# Altium schematic sheet SH4 - PWM + CAN.SchDoc
size Letter
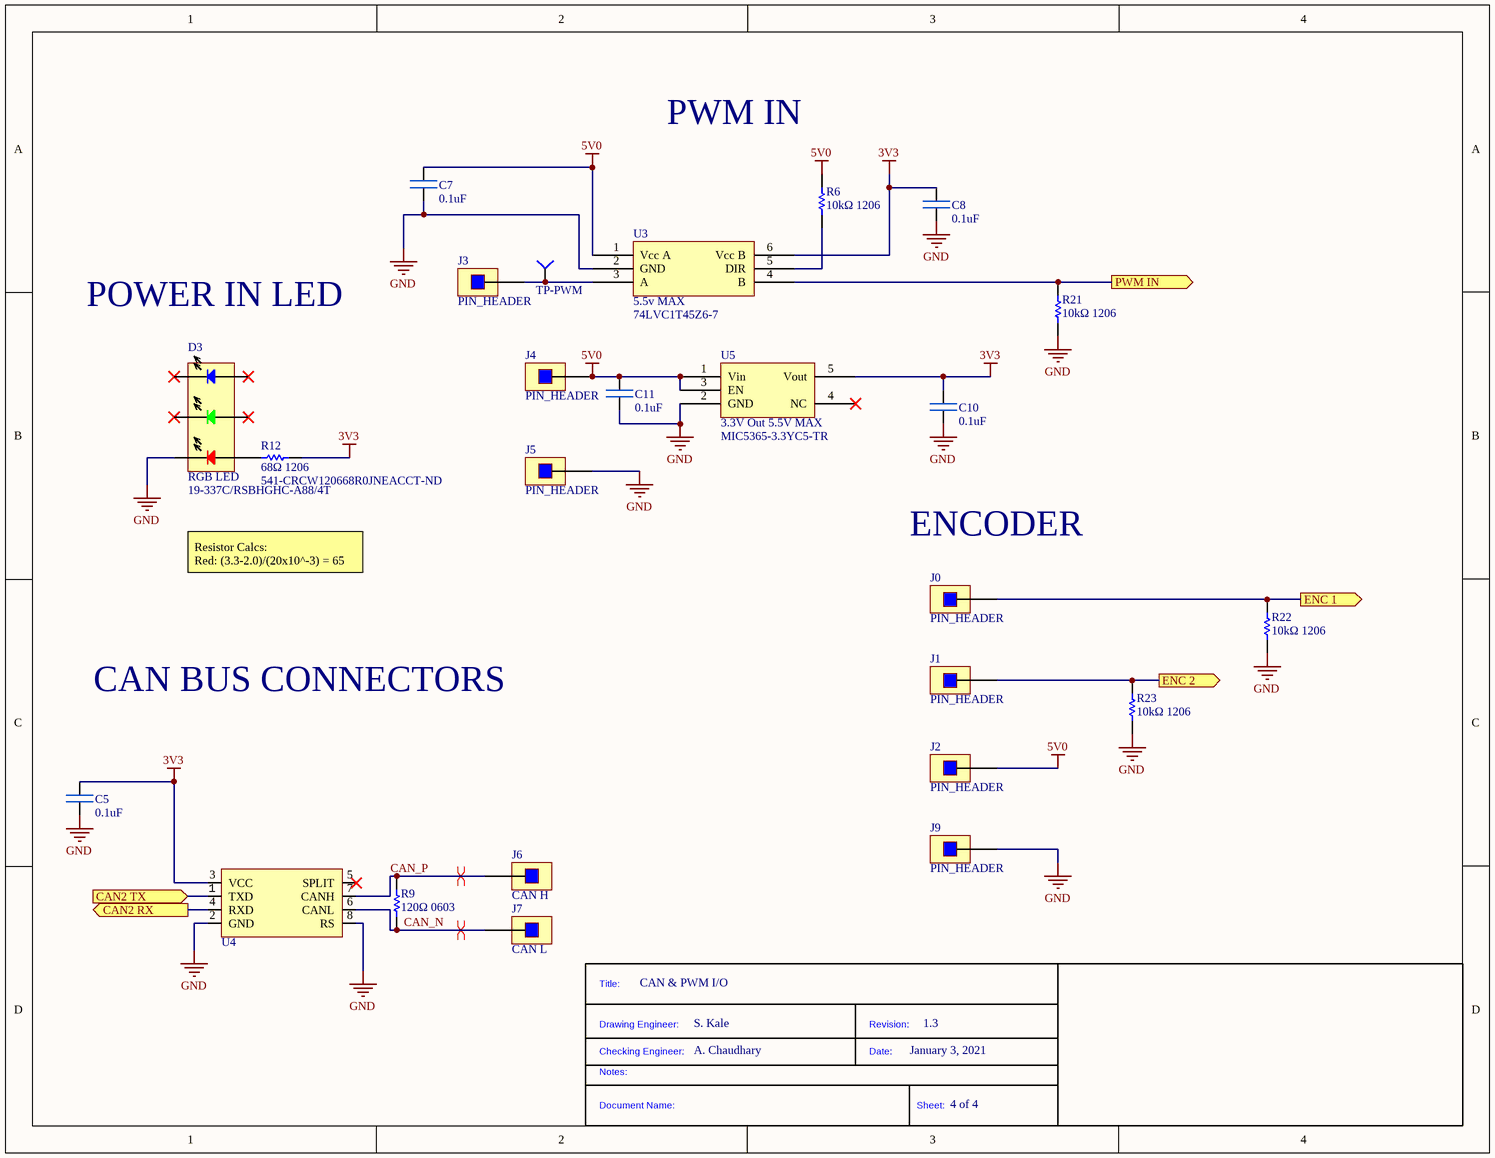
[diagram p0: SH4 - PWM + CAN.SchDoc]

## Parts
*?  HORNET LOGO  (value not drawn)  (graphical)
?  TitleBlock  (value not drawn)  (graphical)
C5  0.1uF  [CAP0.1uF]
C7  0.1uF  [CAP0.1uF]
C8  0.1uF  [CAP0.1uF]
C10  0.1uF  [CAP0.1uF]
C11  0.1uF  [CAP0.1uF]
D3  RGB LED  [19-337C/RSBHGHC-A88/4T]
J0  PIN_HEADER  [PIN_HEADER]
J1  PIN_HEADER  [PIN_HEADER]
J2  PIN_HEADER  [PIN_HEADER]
J3  PIN_HEADER  [PIN_HEADER]
J4  PIN_HEADER  [PIN_HEADER]
J5  PIN_HEADER  [PIN_HEADER]
J6  CAN H  [PIN_HEADER]
J7  CAN L  [PIN_HEADER]
J9  PIN_HEADER  [PIN_HEADER]
R6  10kΩ 1206  [13-RE1206FRE0710KLCT-ND]
R9  120Ω 0603  [SDR03EZPJ200]
R12  68Ω 1206  Supplier Part Number 1: 541-CRCW120668R0JNEACCT-ND  [CRCW120668R0JNEAC]
R21  10kΩ 1206  [13-RE1206FRE0710KLCT-ND]
R22  10kΩ 1206  [13-RE1206FRE0710KLCT-ND]
R23  10kΩ 1206  [13-RE1206FRE0710KLCT-ND]
TP-PWM  TESTPT  [TESTPT SQUARE]  (value not drawn)
U3  5.5v MAX  [74LVC1T45Z6-7]
U4  IC_CAN_TRANSCEIVER  [LT-S8_N]  (value not drawn)
U5  3.3V Out 5.5V MAX  [MIC5365-3.3YC5-TR]

## Ports
CAN2 RX (out), CAN2 TX (in), ENC 1 (out), ENC 2 (out), PWM IN (out)

## Nets
3V3: C5.1 C8.2 C10.1 R12.2 U3.6(Vcc_B) U4.3(VCC) U5.5(Vout)
5V0: C7.1 C11.1 J2.1 J4.1 R6.2 U3.1(Vcc_A) U5.1(Vin) U5.3(EN)
GND: C5.2 C7.2 C8.1 C10.2 C11.2 D3.3(RED_-) J5.1 J9.1 R21.1 R22.1 R23.1 U3.2(GND) U4.2(GND) U4.8(RS) U5.2(GND)
CAN2 RX: U4.4(RXD) ; port CAN2 RX
CAN2 TX: U4.1(TXD) ; port CAN2 TX
CAN_N: J7.1 R9.1 U4.6(CANL)
CAN_P: J6.1 R9.2 U4.7(CANH)
ENC 1: J0.1 R22.2 ; port ENC 1
ENC 2: J1.1 R23.2 ; port ENC 2
PWM IN: R21.2 U3.4(B) ; port PWM IN
NetD3_4: D3.4(Red_+) R12.1
NetJ3_1: J3.1 TP-PWM.1(=value) U3.3(A)
NetR6_1: R6.1 U3.5(DIR)

Not connected (* = marked no-connect by the designer): D3 1(GREEN_-)* 2(Green_+)* 5(BLUE_-)* 6(Blue_+)*; U4 5(SPLIT)*; U5 4(NC)*

## Layout directives
differential pair: CAN_N, CAN_P

## Notes on the sheet
- PWM IN
- POWER IN LED
- Resistor Calcs:
  Red: (3.3-2.0)/(20x10^-3) = 65
- ENCODER
- CAN BUS CONNECTORS
- CAN & PWM I/O
- S. Kale
- 1.3
- A. Chaudhary
- January 3, 2021
- 4 of 4
- (in symbol TitleBlock) Title:; Drawing Engineer:; Revision:; Checking Engineer:; Date:; Notes:; Document Name:; Sheet:

## Library data of the parts
? = TitleBlock: Standard Title Block
C5 C7 C8 C10 C11 = CAP 0.1uF: Ceramic Capacitor, Multilayer, Ceramic, 16V, 10% +Tol, 10% -Tol, X7R, 15% TC, 0.1uF, Surface Mount, 0402; Manufacturer: Murata; Manufacturer Part Number: GRM155R71C104KA88D; Capacitance: 100nF; Multilayer: Yes; Supplier 1: Digi-Key; RoHS: Yes; Category: Ceramic Capacitors; Stock 1: 19996896; Pricing 1: 1=0.10000, 10=0.02100, 50=0.01140, 100=0.00930, 500=0.00666, 1000=0.00523, 2500=0.00476, 5000=0.00438 (USD); Mount: Surface Mount; Number of Pins: 2; Dielectric Material: Ceramic; Size Code: 0402; Terminal Finish: Nickel; Package Shape: Rectangular; Min Operating Temperature: -55°C; Max Operating Temperature: 125°C; JESD-609 Code: e3; Capacitor Type: Ceramic; Negative Tolerance: 10%; Packaging: Tape and Reel; Positive Tolerance: 10%; Rated DC Voltage (URdc): 16V; Temperature Characteristics Code: X7R; Termination: Wraparound; Package Style: SMTMeter; Length: 1mm; Width: 0.5mm; ComponentLink1URL: https://psearch.en.murata.com:443/capacitor/product/GRM155R71C104KA88%23.pdf?src-supplier=IHS+Markit; ComponentLink1Description: https://psearch.en.murata.com:443/capacitor/product/GRM155R71C104KA88%23.pdf?src-supplier=IHS+Markit; ComponentLink2URL: https://datasheet.ciiva.com/129/grm155r71c104ka88-01-129740.pdf?src-supplier=Digi-Key; ComponentLink2Description: https://datasheet.ciiva.com/129/grm155r71c104ka88-01-129740.pdf?src-supplier=Digi-Key; ComponentLink3URL: https://datasheet.ciiva.com/18102/getdatasheetpartid-85307-18102905.pdf?src-supplier=Verical; ComponentLink3Description: https://datasheet.ciiva.com/18102/getdatasheetpartid-85307-18102905.pdf?src-supplier=Verical; ComponentLink4URL: https://datasheet.ciiva.com/129/grm155r71c104ka88-01-129739.pdf?src-supplier=Digi-Key; ComponentLink4Description: https://datasheet.ciiva.com/129/grm155r71c104ka88-01-129739.pdf?src-supplier=Digi-Key; ComponentLink5URL: https://datasheet.ciiva.com/29199/454098-da-01-en-vs-kondensator-0402-29199799.pdf?src-supplier=Conrad; ComponentLink5Description: https://datasheet.ciiva.com/29199/454098-da-01-en-vs-kondensator-0402-29199799.pdf?src-supplier=Conrad; ComponentLink6URL: https://datasheet.ciiva.com/28534/4360-28534133.pdf?src-supplier=Element14; ComponentLink6Description: https://datasheet.ciiva.com/28534/4360-28534133.pdf?src-supplier=Element14; ComponentLink7URL: https://datasheet.ciiva.com/14103/grmseries-highdielectrictype-eng-14103750.pdf?src-supplier=Distrelec; ComponentLink7Description: https://datasheet.ciiva.com/14103/grmseries-highdielectrictype-eng-14103750.pdf?src-supplier=Distrelec; ComponentLink8URL: https://datasheet.ciiva.com/16199/product-16199000.pdf?src-supplier=Future+Electronics; ComponentLink8Description: https://datasheet.ciiva.com/16199/product-16199000.pdf?src-supplier=Future+Electronics; ComponentLink9URL: https://datasheet.ciiva.com/14116/grmseries-highdielectrictype-eng-14116878.pdf?src-supplier=Distrelec; ComponentLink9Description: https://datasheet.ciiva.com/14116/grmseries-highdielectrictype-eng-14116878.pdf?src-supplier=Distrelec; ComponentLink10URL: https://datasheet.ciiva.com/7937/4360-7937615.pdf?src-supplier=Element14; ComponentLink10Description: https://datasheet.ciiva.com/7937/4360-7937615.pdf?src-supplier=Element14; ComponentLink11URL: https://datasheet.ciiva.com/28534/4360-28534127.pdf?src-supplier=Element14; ComponentLink11Description: https://datasheet.ciiva.com/28534/4360-28534127.pdf?src-supplier=Element14; Height: 0.5mm; Supplier Part Number 1: 490-3261-1-ND
D3 = LED_RGB: Tri Color Pcb Top View SMD Led R; Manufacturer: Everlight; Supplier 1: Digi-Key; Manufacturer Part Number: 19-337C/RSBHGHC-A88/4T; RoHS: No; Category: LEDs; Stock 1: 109225; Pricing 1: 1=0.40000, 10=0.24400, 100=0.14030, 1000=0.10980, 2000=0.10065 (USD); Supplier Part Number 1: 1080-1631-1-ND
J0-J7 J9 = PIN_HEADER: Board Connector, 1 Contact(s), 1 Row(s), Male, Straight, Solder Terminal; Manufacturer: Sullins; Manufacturer Part Number: PREC001SAAN-RC; Option: General Purpose; Filter Feature: No; Number of Rows Loaded: 1; Supplier 1: Digi-Key; RoHS: Yes; Category: Connectors; Stock 1: 16681; Pricing 1: 1=0.04000, 10=0.03000, 25=0.02800, 50=0.02080, 100=0.01780, 250=0.01724, 500=0.01486 (USD); Mount: Board; Connector Type: BOARD CONNECTOR; Contact Gender: Male; Mixed Contacts: No; Mounting Style: STRAIGHT; Termination: Solder; Number of Contacts: 1; Flammability Rating: UL94 V-0; DIN Conformance: No; IEC Conformance: No; MIL Conformance: No; ComponentLink1URL: https://datasheet.ciiva.com:443/pdfs/VipMasterIC/IC/SUCS/SUCS-S-A0005121173/SUCS-S-A0005121173-1.pdf?src-supplier=IHS+Markit; ComponentLink1Description: https://datasheet.ciiva.com:443/pdfs/VipMasterIC/IC/SUCS/SUCS-S-A0005121173/SUCS-S-A0005121173-1.pdf?src-supplier=IHS+Markit; ComponentLink2URL: https://datasheet.ciiva.com/740/zrzczzzszzn-rc-st-11635-b-740844.pdf?src-supplier=Digi-Key; ComponentLink2Description: https://datasheet.ciiva.com/740/zrzczzzszzn-rc-st-11635-b-740844.pdf?src-supplier=Digi-Key; Supplier Part Number 1: S1012EC-01-ND
R6 R21-R23 = RES 10k Ω: Fixed Resistor, Metal Glaze/thick Film, 0.25W, 10000ohm, 200V, 1% +/-Tol, 50ppm/Cel, Surface Mount, 1206; Manufacturer: Yageo; Manufacturer Part Number: RE1206FRE0710KL; Supplier 1: Digi-Key; RoHS: Yes; Category: Chip SMD Resistors; Stock 1: 6708; Pricing 1: 1=0.10000, 10=0.05900, 100=0.02390, 1000=0.01073, 2500=0.00932 (USD); ComponentLink1URL: https://datasheet.ciiva.com:443/pdfs/VipMasterIC/IC/YAGO/YAGO-S-A0003975721/YAGO-S-A0003975721-1.pdf?src-supplier=IHS+Markit; ComponentLink1Description: https://datasheet.ciiva.com:443/pdfs/VipMasterIC/IC/YAGO/YAGO-S-A0003975721/YAGO-S-A0003975721-1.pdf?src-supplier=IHS+Markit; ComponentLink2URL: http://www.yageo.com/NewPortal/yageodocoutput?fileName=/pdf/R-Chip/PYu-RE_105_RoHS_L_4.pdf&src-supplier=Digi-Key; ComponentLink2Description: http://www.yageo.com/NewPortal/yageodocoutput?fileName=/pdf/R-Chip/PYu-RE_105_RoHS_L_4.pdf&src-supplier=Digi-Key; Supplier Part Number 1: 13-RE1206FRE0710KLCT-ND
R9 = RES 120: Fixed Resistor, 0.1W, 120ohm, 50V, 5% +/-Tol, 200ppm/Cel, Surface Mount, 0603; Manufacturer: Rohm; Manufacturer Part Number: SDR03EZPJ121; Supplier 1: Digi-Key; RoHS: No; Category: Chip SMD Resistors; Stock 1: 4798; Pricing 1: 1=0.10000, 10=0.07300, 100=0.02800, 1000=0.01232, 2500=0.01064 (USD); ComponentLink1URL: https://datasheet.ciiva.com:443/pdfs/VipMasterIC/IC/ROHM/ROHM-S-A0002832543/ROHM-S-A0002832543-1.pdf?src-supplier=IHS+Markit; ComponentLink1Description: https://datasheet.ciiva.com:443/pdfs/VipMasterIC/IC/ROHM/ROHM-S-A0002832543/ROHM-S-A0002832543-1.pdf?src-supplier=IHS+Markit; ComponentLink2URL: https://www.rohm.com/datasheet/SDR03EZPJ/sdr-e?src-supplier=Digi-Key; ComponentLink2Description: https://www.rohm.com/datasheet/SDR03EZPJ/sdr-e?src-supplier=Digi-Key; Supplier Part Number 1: 511-1735-1-ND
R12 = RES 68Ω: VISCRCW120668R0JNEAC Res Thick Film 1206; Manufacturer: Vishay; Tolerance: 5%; Rated Power Dissipation (P): 250mW; Resistance: 68R; Temperature Coefficient: -200200ppm/°C; Working Voltage: 200V; Package Height: 0.55mm; Package Length: 3.05mm; Package Width: 1.55mm; Supplier 1: Digi-Key; Manufacturer Part Number: CRCW120668R0JNEAC; Stock 1: 24990; Pricing 1: 1=0.10000, 10=0.06300, 100=0.02570, 1000=0.01153, 2500=0.01000 (USD); Number of Pins: 2; Size Code: 1206; Terminal Finish: Nickel; Min Operating Temperature: -55°C; Max Operating Temperature: 155°C; JESD-609 Code: e3; Resistor Type: FIXED RESISTOR; Construction: Chip; Package Style: SMTMeter; Packaging: Tape and Reel; Technology: METAL GLAZE/THICK FILM; ComponentLink1URL: https://datasheet.ciiva.com:443/pdfs/VipMasterIC/IC/VISH/VISH-S-A0003599164/VISH-S-A0003599164-1.pdf?src-supplier=IHS+Markit; ComponentLink1Description: https://datasheet.ciiva.com:443/pdfs/VipMasterIC/IC/VISH/VISH-S-A0003599164/VISH-S-A0003599164-1.pdf?src-supplier=IHS+Markit
TP-PWM = TESTPT SQUARE
U3 = Bi-Directional Logic Converter: Bus Transceiver, LVC/LCX/Z Series, 1-Func, 1-Bit, True Output, CMOS, PDSO6; Manufacturer: Diodes; Package Body Material: Plastic; Control Type: COMMON CONTROL; Count Direction: Bidirectional; Load/Preset Input: Yes; Max I(ol): 24mA; Number of Bits: 1; Number of Ports: 2; Output Characteristics: 3-STATE; Power Supplies: 3.3V; Supply Voltage-Min (Vsup): 1.65V; Qualification Status: Not Qualified; Supplier 1: Digi-Key; Manufacturer Part Number: 74LVC1T45Z6-7; RoHS: Yes; Category: Logic ICs; Stock 1: 88129; Pricing 1: 1=0.39000, 10=0.29300, 25=0.26400, 100=0.18240, 250=0.15360, 500=0.12480, 1000=0.09600 (USD); Package Code: VSOF; Number of Pins: 6; Package Shape: Rectangular; Terminal Finish: Tin; Min Operating Temperature: -40°C; Max Operating Temperature: 125°C; JESD-609 Code: e3; Output Polarity: True; JESD-30 Code: R-PDSO-F6; Logic IC Type: BUS TRANSCEIVER; Moisture Sensitivity Level: 1; Number of Functions: 1; Package Style: SMALL OUTLINE, VERY THIN PROFILEMeter; Packaging: Tape and Reel; Supply Voltage-Max (Vsup): 5.5V; Supply Voltage-Nom (Vsup): 3.3V; Surface Mount: Yes; Technology: CMOS; Terminal Form: Flat; Terminal Position: DUAL; Width: 1.2mm; Height - Seated (Max): 0.6mm; Terminal Pitch: 0.5mm; Temperature Grade: AUTOMOTIVE; ComponentLink1URL: https://datasheet.ciiva.com:443/pdfs/VipMasterIC/IC/DIOD/DIOD-S-A0006644025/DIOD-S-A0006644025-1.pdf?src-supplier=IHS+Markit; ComponentLink1Description: https://datasheet.ciiva.com:443/pdfs/VipMasterIC/IC/DIOD/DIOD-S-A0006644025/DIOD-S-A0006644025-1.pdf?src-supplier=IHS+Markit; ComponentLink2URL: http://www.mouser.com/ds/2/115/74LVC1T45-318124.pdf?src-supplier=Mouser; ComponentLink2Description: http://www.mouser.com/ds/2/115/74LVC1T45-318124.pdf?src-supplier=Mouser; ComponentLink3URL: http://diodes.com/datasheets/74LVC1T45.pdf?src-supplier=Avnet; ComponentLink3Description: http://diodes.com/datasheets/74LVC1T45.pdf?src-supplier=Avnet; ComponentLink4URL: https://www.diodes.com/assets/Datasheets/74LVC1T45.pdf?src-supplier=Digi-Key; ComponentLink4Description: https://www.diodes.com/assets/Datasheets/74LVC1T45.pdf?src-supplier=Digi-Key; Supplier Part Number 1: 74LVC1T45Z6-7DICT-ND
U4 = IC_CAN_TRANSCEIVER: IC TXRX CAN 4MBPS 8SO; Manufacturer 1: Linear Technologies; Manufacturer Part Number 1: LTC2875IS8#PBF; Package/Footprint: 8-SOIC; Supplier Part Number 1: LTC2875IS8#PBF-ND; Supplier 1: Digi-Key; Mounting Type: SMD; LCSC Part #: C117076
U5 = LDO 5.5/3.3V: Microchip Technology MIC5365-3.3YC5-TR, LDO Voltage Regulator Controller, 150mA, 3.3 V, ±3% 5-Pin, SC-75; Supplier 1: Digi-Key; Manufacturer: Microchip; Manufacturer Part Number: MIC5365-3.3YC5-TR; RoHS: Yes; Category: Voltage Regulators - Linear; Stock 1: 5958; Pricing 1: 1=0.12000, 25=0.10000, 100=0.09000 (USD); ComponentLink1URL: https://datasheet.ciiva.com/16466/mic5365-16466603.pdf?src-supplier=Future+Electronics; ComponentLink1Description: https://datasheet.ciiva.com/16466/mic5365-16466603.pdf?src-supplier=Future+Electronics; Supplier Part Number 1: 576-3193-1-ND